# Altium schematic sheet Drivers.SchDoc
size A4
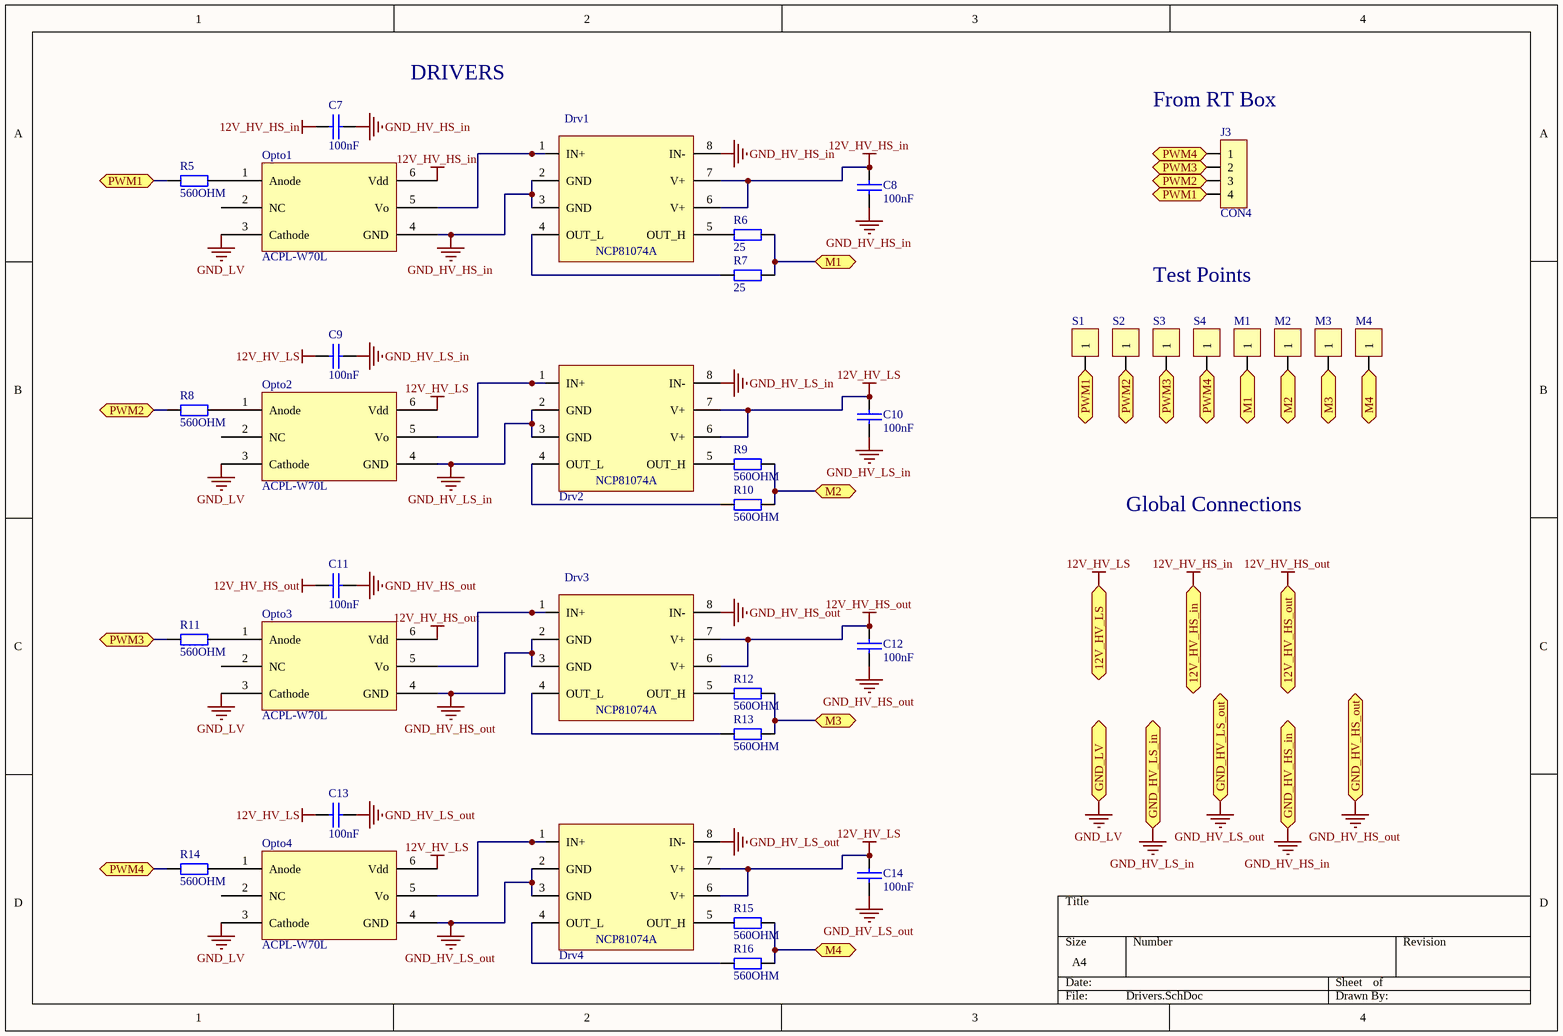
[diagram p0: Drivers.SchDoc]

## Parts
C7  100nF  [Cap100nF_AAU]
C8  100nF  [Cap100nF_AAU]
C9  100nF  [Cap100nF_AAU]
C10  100nF  [Cap100nF_AAU]
C11  100nF  [Cap100nF_AAU]
C12  100nF  [Cap100nF_AAU]
C13  100nF  [Cap100nF_AAU]
C14  100nF  [Cap100nF_AAU]
Drv1  NCP81074A  [NCP81074A]  (value not drawn)
Drv2  NCP81074A  [NCP81074A]  (value not drawn)
Drv3  NCP81074A  [NCP81074A]  (value not drawn)
Drv4  NCP81074A  [NCP81074A]  (value not drawn)
J3  CON4  [Con4_Extron _3.5mmPitch]
M1  Test Point  [Test_Point]  (value not drawn)
M2  Test Point  [Test_Point]  (value not drawn)
M3  Test Point  [Test_Point]  (value not drawn)
M4  Test Point  [Test_Point]  (value not drawn)
Opto1  ACPL-W70L  [SSOIC6]
Opto2  ACPL-W70L  [SSOIC6]
Opto3  ACPL-W70L  [SSOIC6]
Opto4  ACPL-W70L  [SSOIC6]
R5  560OHM  [1206]
R6  25  [1206]
R7  25  [1206]
R8  560OHM  [1206]
R9  560OHM  [1206]
R10  560OHM  [1206]
R11  560OHM  [1206]
R12  560OHM  [1206]
R13  560OHM  [1206]
R14  560OHM  [1206]
R15  560OHM  [1206]
R16  560OHM  [1206]
S1  Test Point  [Test_Point]  (value not drawn)
S2  Test Point  [Test_Point]  (value not drawn)
S3  Test Point  [Test_Point]  (value not drawn)
S4  Test Point  [Test_Point]  (value not drawn)

## Ports
12V_HV_HS_in, 12V_HV_HS_out, 12V_HV_LS, GND_HV_HS_in, GND_HV_HS_out, GND_HV_LS_in, GND_HV_LS_out, GND_LV, M1, M2, M3, M4, PWM1, PWM2, PWM3, PWM4

## Nets
12V_HV_HS_in: C7.1 C8.2 Drv1.6(V+) Drv1.7(V+) Opto1.6(Vdd) ; port 12V_HV_HS_in
12V_HV_HS_out: C11.1 C12.2 Drv3.6(V+) Drv3.7(V+) Opto3.6(Vdd) ; port 12V_HV_HS_out
12V_HV_LS: C9.1 C10.2 C13.1 C14.2 Drv2.6(V+) Drv2.7(V+) Drv4.6(V+) Drv4.7(V+) Opto2.6(Vdd) Opto4.6(Vdd) ; port 12V_HV_LS
GND_HV_HS_in: C7.2 C8.1 Drv1.2(GND) Drv1.3(GND) Drv1.8(IN-) Opto1.4(GND) ; port GND_HV_HS_in
GND_HV_HS_out: C11.2 C12.1 Drv3.2(GND) Drv3.3(GND) Drv3.8(IN-) Opto3.4(GND) ; port GND_HV_HS_out
GND_HV_LS_in: C9.2 C10.1 Drv2.2(GND) Drv2.3(GND) Drv2.8(IN-) Opto2.4(GND) ; port GND_HV_LS_in
GND_HV_LS_out: C13.2 C14.1 Drv4.2(GND) Drv4.3(GND) Drv4.8(IN-) Opto4.4(GND) ; port GND_HV_LS_out
GND_LV: Opto1.3(Cathode) Opto2.3(Cathode) Opto3.3(Cathode) Opto4.3(Cathode) ; port GND_LV
M1: M1.1 R6.1 R7.1 ; port M1
M2: M2.1 R9.1 R10.1 ; port M2
M3: M3.1 R12.1 R13.1 ; port M3
M4: M4.1 R15.1 R16.1 ; port M4
PWM1: J3.4 R5.2 S1.1 ; port PWM1
PWM2: J3.3 R8.2 S2.1 ; port PWM2
PWM3: J3.2 R11.2 S3.1 ; port PWM3
PWM4: J3.1 R14.2 S4.1 ; port PWM4
NetDrv1_1: Drv1.1(IN+) Opto1.5(Vo)
NetDrv1_4: Drv1.4(OUT_L) R7.2
NetDrv1_5: Drv1.5(OUT_H) R6.2
NetDrv2_1: Drv2.1(IN+) Opto2.5(Vo)
NetDrv2_4: Drv2.4(OUT_L) R10.2
NetDrv2_5: Drv2.5(OUT_H) R9.2
NetDrv3_1: Drv3.1(IN+) Opto3.5(Vo)
NetDrv3_4: Drv3.4(OUT_L) R13.2
NetDrv3_5: Drv3.5(OUT_H) R12.2
NetDrv4_1: Drv4.1(IN+) Opto4.5(Vo)
NetDrv4_4: Drv4.4(OUT_L) R16.2
NetDrv4_5: Drv4.5(OUT_H) R15.2
NetOpto1_1: Opto1.1(Anode) R5.1
NetOpto2_1: Opto2.1(Anode) R8.1
NetOpto3_1: Opto3.1(Anode) R11.1
NetOpto4_1: Opto4.1(Anode) R14.1

Not connected (* = marked no-connect by the designer): Opto1 2(NC); Opto2 2(NC); Opto3 2(NC); Opto4 2(NC)

## Notes on the sheet
- DRIVERS
- (near J3) From RT Box
- Test Points
- Global Connections

## Library data of the parts
C7-C14 = Condensador
R5-R16 = Resistencia: Potencia: 1/4W